# Altium schematic sheet USB_HUB.SchDoc
size A3; SheetNumber: 11; SheetTotal: 18; SPICEModelCacheFROIBYYA: <root> / <DocumentId>FROIBYYA</DocumentId> / </root>
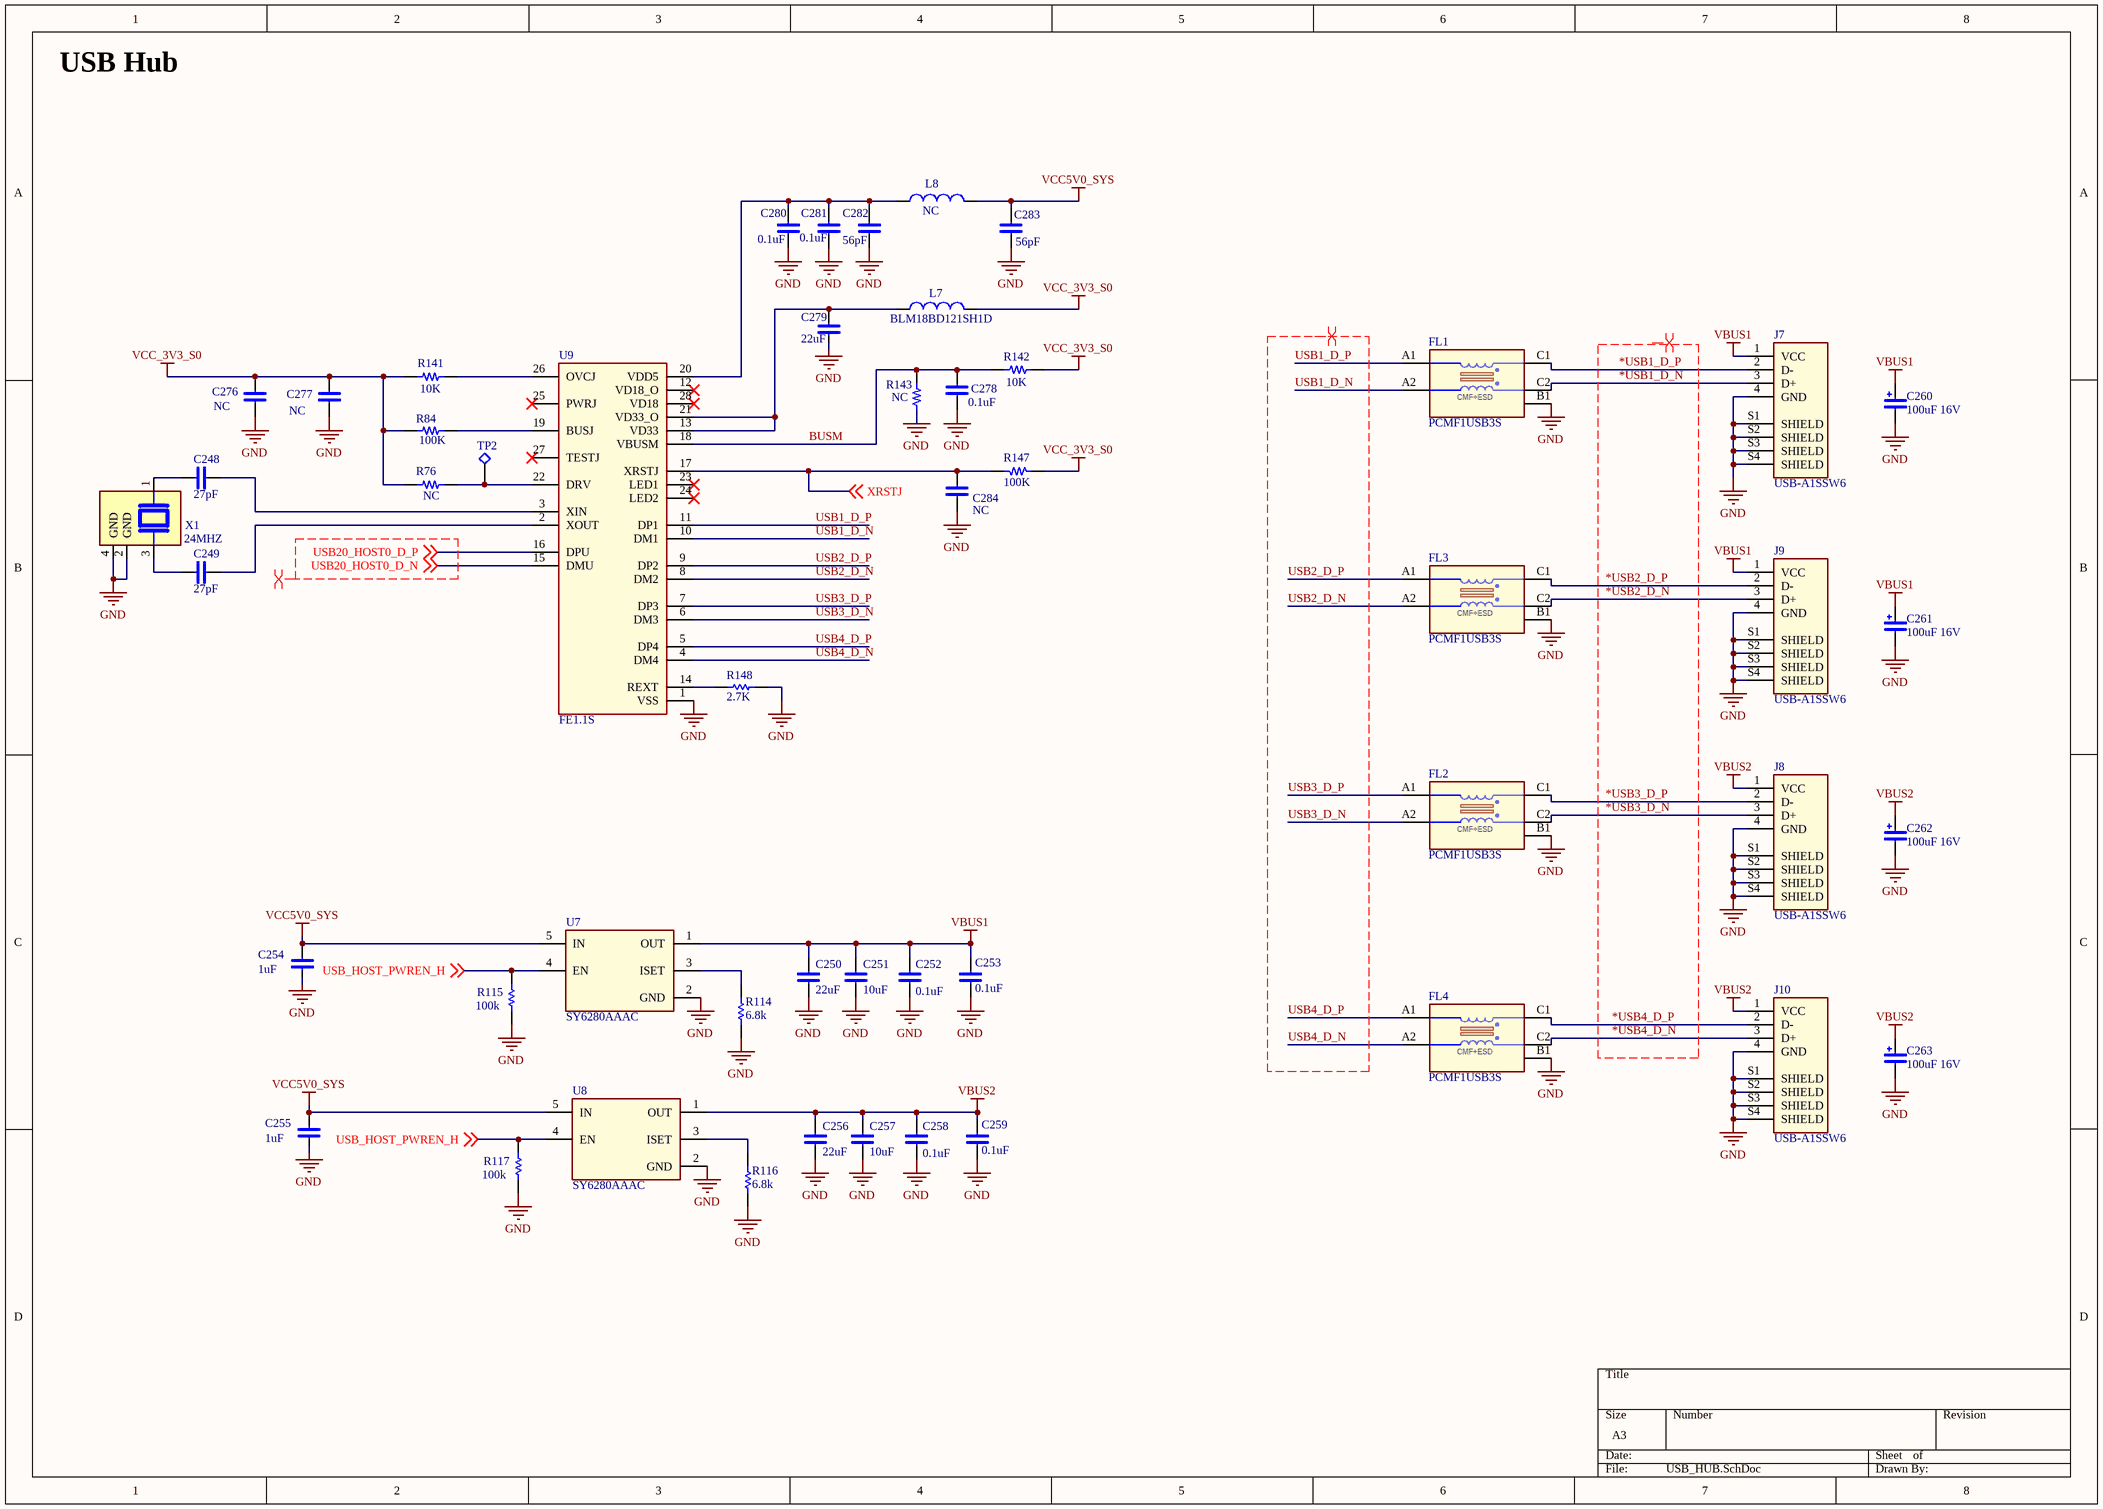
[diagram p0: USB_HUB.SchDoc]

## Parts
C248  27pF  [C-0402/1005]
C249  27pF  [C-0402/1005]
C250  22uF  [C-0603/1608]
C251  10uF  [C-0603/1608]
C252  0.1uF  [C-0201/0603]
C253  0.1uF  [C-0201/0603]
C254  1uF  [C-0402/1005]
C255  1uF  [C-0402/1005]
C256  22uF  [C-0603/1608]
C257  10uF  [C-0603/1608]
C258  0.1uF  [C-0201/0603]
C259  0.1uF  [C-0201/0603]
C260  100uF 16V  [CAP_2312 TAN]
C261  100uF 16V  [CAP_2312 TAN]
C262  100uF 16V  [CAP_2312 TAN]
C263  100uF 16V  [CAP_2312 TAN]
C276  NC  [C-0402/1005]
C277  NC  [C-0402/1005]
C278  0.1uF  [C-0201/0603]
C279  22uF  [C-0603/1608]
C280  0.1uF  [C-0201/0603]
C281  0.1uF  [C-0201/0603]
C282  56pF  [C-0201/0603]
C283  56pF  [C-0201/0603]
C284  NC  [C-0402/1005]
FL1  PCMF1USB3S  [WLCSP5(2-1-2)_NEX]
FL2  PCMF1USB3S  [WLCSP5(2-1-2)_NEX]
FL3  PCMF1USB3S  [WLCSP5(2-1-2)_NEX]
FL4  PCMF1USB3S  [WLCSP5(2-1-2)_NEX]
J7  USB-A1SSW6  [ONSHORE_USB-A1SSW6]
J8  USB-A1SSW6  [ONSHORE_USB-A1SSW6]
J9  USB-A1SSW6  [ONSHORE_USB-A1SSW6]
J10  USB-A1SSW6  [ONSHORE_USB-A1SSW6]
L7  BLM18BD121SH1D  [BEAD_0603]
L8  NC  [BEAD_0603]
R76  NC  [R-0201/0603]
R84  100K  [R-0201/0603]
R114  6.8k  [R-0201/0603]
R115  100k  [R-0201/0603]
R116  6.8k  [R-0201/0603]
R117  100k  [R-0201/0603]
R141  10K  [R-0201/0603]
R142  10K  [R-0201/0603]
R143  NC  [R-0201/0603]
R147  100K  [R-0201/0603]
R148  2.7K  [R-0201/0603]
TP2  Test Points  [D1.8-H1mm]  (value not drawn)
U7  SY6280AAAC  [SOT-23-5]
U8  SY6280AAAC  [SOT-23-5]
U9  FE1.1S  [FE1.1S_SSOP-28]
X1  24MHZ  [3.2*2.5 CRYSTAL]

## Nets
GND: C250.2 C251.2 C252.2 C253.2 C254.2 C255.2 C256.2 C257.2 C258.2 C259.2 C260.- C261.- C262.- C263.- C276.2 C277.2 C278.2 C279.2 C280.2 C281.2 C282.2 C283.2 C284.2 FL1.B1(GND) FL2.B1(GND) FL3.B1(GND) FL4.B1(GND) J7.4(GND) J7.S1(SHIELD) J7.S2(SHIELD) J7.S3(SHIELD) J7.S4(SHIELD) J8.4(GND) J8.S1(SHIELD) J8.S2(SHIELD) J8.S3(SHIELD) J8.S4(SHIELD) J9.4(GND) J9.S1(SHIELD) J9.S2(SHIELD) J9.S3(SHIELD) J9.S4(SHIELD) J10.4(GND) J10.S1(SHIELD) J10.S2(SHIELD) J10.S3(SHIELD) J10.S4(SHIELD) R114.1 R115.1 R116.1 R117.1 R143.2 R148.2 U7.2(GND) U8.2(GND) U9.1(VSS) X1.2(GND) X1.4(GND)
VBUS1: C250.1 C251.1 C252.1 C253.1 C260.+ C261.+ J7.1(VCC) J9.1(VCC) U7.1(OUT)
VBUS2: C256.1 C257.1 C258.1 C259.1 C262.+ C263.+ J8.1(VCC) J10.1(VCC) U8.1(OUT)
VCC5V0_SYS: C254.1 C255.1 C283.1 L8.1 U7.5(IN) U8.5(IN)
VCC_3V3_S0: C276.1 C277.1 L7.1 R76.1 R84.2 R141.2 R142.1 R147.1
*USB1_D_N: FL1.C2(CH1_OUT-) J7.3(D+)
*USB1_D_P: FL1.C1(CH1_OUT+) J7.2(D-)
*USB2_D_N: FL3.C2(CH1_OUT-) J9.3(D+)
*USB2_D_P: FL3.C1(CH1_OUT+) J9.2(D-)
*USB3_D_N: FL2.C2(CH1_OUT-) J8.3(D+)
*USB3_D_P: FL2.C1(CH1_OUT+) J8.2(D-)
*USB4_D_N: FL4.C2(CH1_OUT-) J10.3(D+)
*USB4_D_P: FL4.C1(CH1_OUT+) J10.2(D-)
BUSM: C278.1 R142.2 R143.1 U9.18(VBUSM)
USB1_D_N: FL1.A2(CH1_IN-) U9.10(DM1)
USB1_D_P: FL1.A1(CH1_IN+) U9.11(DP1)
USB2_D_N: FL3.A2(CH1_IN-) U9.8(DM2)
USB2_D_P: FL3.A1(CH1_IN+) U9.9(DP2)
USB3_D_N: FL2.A2(CH1_IN-) U9.6(DM3)
USB3_D_P: FL2.A1(CH1_IN+) U9.7(DP3)
USB4_D_N: FL4.A2(CH1_IN-) U9.4(DM4)
USB4_D_P: FL4.A1(CH1_IN+) U9.5(DP4)
USB20_HOST0_D_N: U9.15(DMU) ; off-sheet USB20_HOST0_D_N
USB20_HOST0_D_P: U9.16(DPU) ; off-sheet USB20_HOST0_D_P
USB_HOST_PWREN_H: R115.2 R117.2 U7.4(EN) U8.4(EN) ; off-sheet USB_HOST_PWREN_H
XRSTJ: C284.1 R147.2 U9.17(XRSTJ) ; off-sheet XRSTJ
NetC248_1: C248.1 U9.3(XIN)
NetC248_2: C248.2 X1.1
NetC249_1: C249.1 U9.2(XOUT)
NetC249_2: C249.2 X1.3
NetC279_1: C279.1 L7.2 U9.13(VD33) U9.21(VD33_O)
NetC280_1: C280.1 C281.1 C282.1 L8.2 U9.20(VDD5)
NetR76_2: R76.2 TP2.1 U9.22(DRV)
NetR84_1: R84.1 U9.19(BUSJ)
NetR114_2: R114.2 U7.3(ISET)
NetR116_2: R116.2 U8.3(ISET)
NetR141_1: R141.1 U9.26(OVCJ)
NetR148_1: R148.1 U9.14(REXT)

Not connected (* = marked no-connect by the designer): U9 12(VD18_O)* 23(LED1)* 24(LED2)* 25(PWRJ)* 27(TESTJ)* 28(VD18)*

## Layout directives
differential pair; differential pair class 90R: *USB1_D_N, *USB1_D_P, *USB2_D_N, *USB2_D_P, *USB3_D_N, *USB3_D_P, *USB4_D_N, *USB4_D_P, USB1_D_N, USB1_D_P, USB2_D_N, USB2_D_P, USB3_D_N, USB3_D_P, USB4_D_N, USB4_D_P, USB20_HOST0_D_N, USB20_HOST0_D_P

## Notes on the sheet
- USB Hub
- (in symbol Nexperia, PCMF1USB3SZ) CMF+ESD

## Library data of the parts
C248 C249 = Capacitor-NonPolar: 27pF/50V; Mfr. Part No.: GRM21BR71A106KA73K; Value: 10uF 10V; Unit Price (USD): 0.19; Supplier Part No.: 490-14381-1-ND; Supplier: Digikey Electronics
C250 C251 C254-C257 = Capacitor-NonPolar: CAP CER 10UF 10V X7R 0805; Mfr. Part No.: GRM21BR71A106KA73K; Unit Price (USD): 0.19; Value: 10uF 10V; Supplier Part No.: 490-14381-1-ND; Supplier: Digikey Electronics
C252 C253 C258 C259 C278 C280 C281 = Capacitor-NonPolar: 0.1uF / C0201; Mfr. Part No.: GRM21BR71A106KA73K; Value: 10uF 10V; Unit Price (USD): 0.19; Supplier Part No.: 490-14381-1-ND; Supplier: Digikey Electronics
C260-C263 = Capacitor-Polar: CAP TANT 10UF 10% 16V 1206; Mfr. Part No.: F931C106KAAAJ6; Unit Price (USD): 0.67; Value: 10uF 16V; Supplier Part No.: 478-10723-1-ND; Supplier: Digikey Electronics
C276 C284 = Capacitor-NonPolar: NC / C0402 / X5R; Mfr. Part No.: GRM21BR71A106KA73K; Value: 10uF 10V; Unit Price (USD): 0.19; Supplier Part No.: 490-14381-1-ND; Supplier: Digikey Electronics
C277 = Capacitor-NonPolar: NC / C0603 / X5R; Mfr. Part No.: GRM21BR71A106KA73K; Value: 10uF 10V; Unit Price (USD): 0.19; Supplier Part No.: 490-14381-1-ND; Supplier: Digikey Electronics
C279 = Capacitor-NonPolar: 22uF/10V / C0603; Mfr. Part No.: GRM21BR71A106KA73K; Value: 10uF 10V; Unit Price (USD): 0.19; Supplier Part No.: 490-14381-1-ND; Supplier: Digikey Electronics
C282 C283 = Capacitor-NonPolar: 56pF/16V; Mfr. Part No.: GRM21BR71A106KA73K; Value: 10uF 10V; Unit Price (USD): 0.19; Supplier Part No.: 490-14381-1-ND; Supplier: Digikey Electronics
FL1-FL4 = Nexperia, PCMF1USB3SZ: FLT, SMT, WLCSP5, Common Mode EMI Filters; Supply Voltage: NO; Notes: NC; Value: PCMF1USB3S; Manufacturer: Nexperia; Mounting: SMT; Operating Temperature: -40ºC ~ +125ºC; Subpart Type: Common Mode EMI Filters; Footprint: WLCSP5; Manufacturer Part Number: PCMF1USB3S; Datasheet Link: https://www.nexperia.com/products/esd-protection-tvs-filtering-and-signal-conditioning/emi-solutions-with-integrated-protection/common-mode-filters-with-integrated-protection/PCMF1USB3S.html; Supply Current: NO; Substitutes Allowed: NO; Height: 0.6mm
J7-J10 = USB-A1SSW6: USB-A (USB TYPE-A) - Receptacle Connector 4 Position Through Hole, Right Angle; MF: On Shore; Value: *; SnapEDA_Link: https://www.snapeda.com/parts/USB-A1SSW6/On+Shore+Technology+Inc./view-part/?ref=snap; Purchase-URL: https://pricing.snapeda.com/search/part/USB-A1SSW6/?ref=eda; Availability: In Stock; Price: None; Package: None; Check_prices: https://www.snapeda.com/parts/USB-A1SSW6/On+Shore+Technology+Inc./view-part/?ref=eda; MP: USB-A1SSW6
L7 L8 = Inductor: Code_IEC: 1005; Value: 10mH; Published: 8-Jun-2000; LatestRevisionDate: 29-May-2009; LatestRevisionNote: IPC-7351 Footprint Added.; PackageReference: 0402-A; Publisher: Altium Limited; PackageDescription: Chip Inductor; Code_JEITA: 0402
R76 = Resistor: 1K / R0201; Mfr. Part No.: MCR01MZPF1502; Value: 15k 1%; Unit Price (USD): 0.1; Supplier Part No.: RHM15.0KLTR-ND; Supplier: Digikey Electronics
R84 R141-R143 R147 = Resistor: 5% R0201 10K; Mfr. Part No.: MCR01MZPF1502; Value: 15k 1%; Unit Price (USD): 0.1; Supplier Part No.: RHM15.0KLTR-ND; Supplier: Digikey Electronics
R114-R117 R148 = Res1: 2.7K/1% R0201; Value: 1K; Published: 8-Jun-2000; LatestRevisionDate: 17-Jul-2002; LatestRevisionNote: Re-released for DXP Platform.; PackageReference: AXIAL-0.3; Publisher: Altium Limited; PackageDescription: Axial Device, Thru-Hole; 2 Leads; 0.3 in Pin Spacing
U9 = FE1.1S: TSSOP28; MF: terminus; Check_prices: https://www.snapeda.com/parts/FE1.1S/Terminus-Tech/view-part/?ref=eda; Package: None; Availability: Not in stock; Value: *; MP: FE1.1S; SnapEDA_Link: https://www.snapeda.com/parts/FE1.1S/Terminus-Tech/view-part/?ref=snap; Price: None
X1 = ABM8G-25.000MHZ-4Y-T3: MF: Abracon; Price: None; Value: *; Check_prices: https://www.snapeda.com/parts/ABM8G-25.000MHZ-4Y-T3/Abracon+LLC/view-part/?ref=eda; Purchase-URL: https://pricing.snapeda.com/search/part/ABM8G-25.000MHZ-4Y-T3/?ref=eda; Package: SMD-4 Abracon; SnapEDA_Link: https://www.snapeda.com/parts/ABM8G-25.000MHZ-4Y-T3/Abracon+LLC/view-part/?ref=snap; Availability: In Stock; MP: ABM8G-25.000MHZ-4Y-T3
U7 U8 = SY6280AAAC: Package: None; Price: None; Value: *; MP: SY6280AAAC; Availability: Unavailable